# EAGLE design centerboard (EAGLE 5.09)
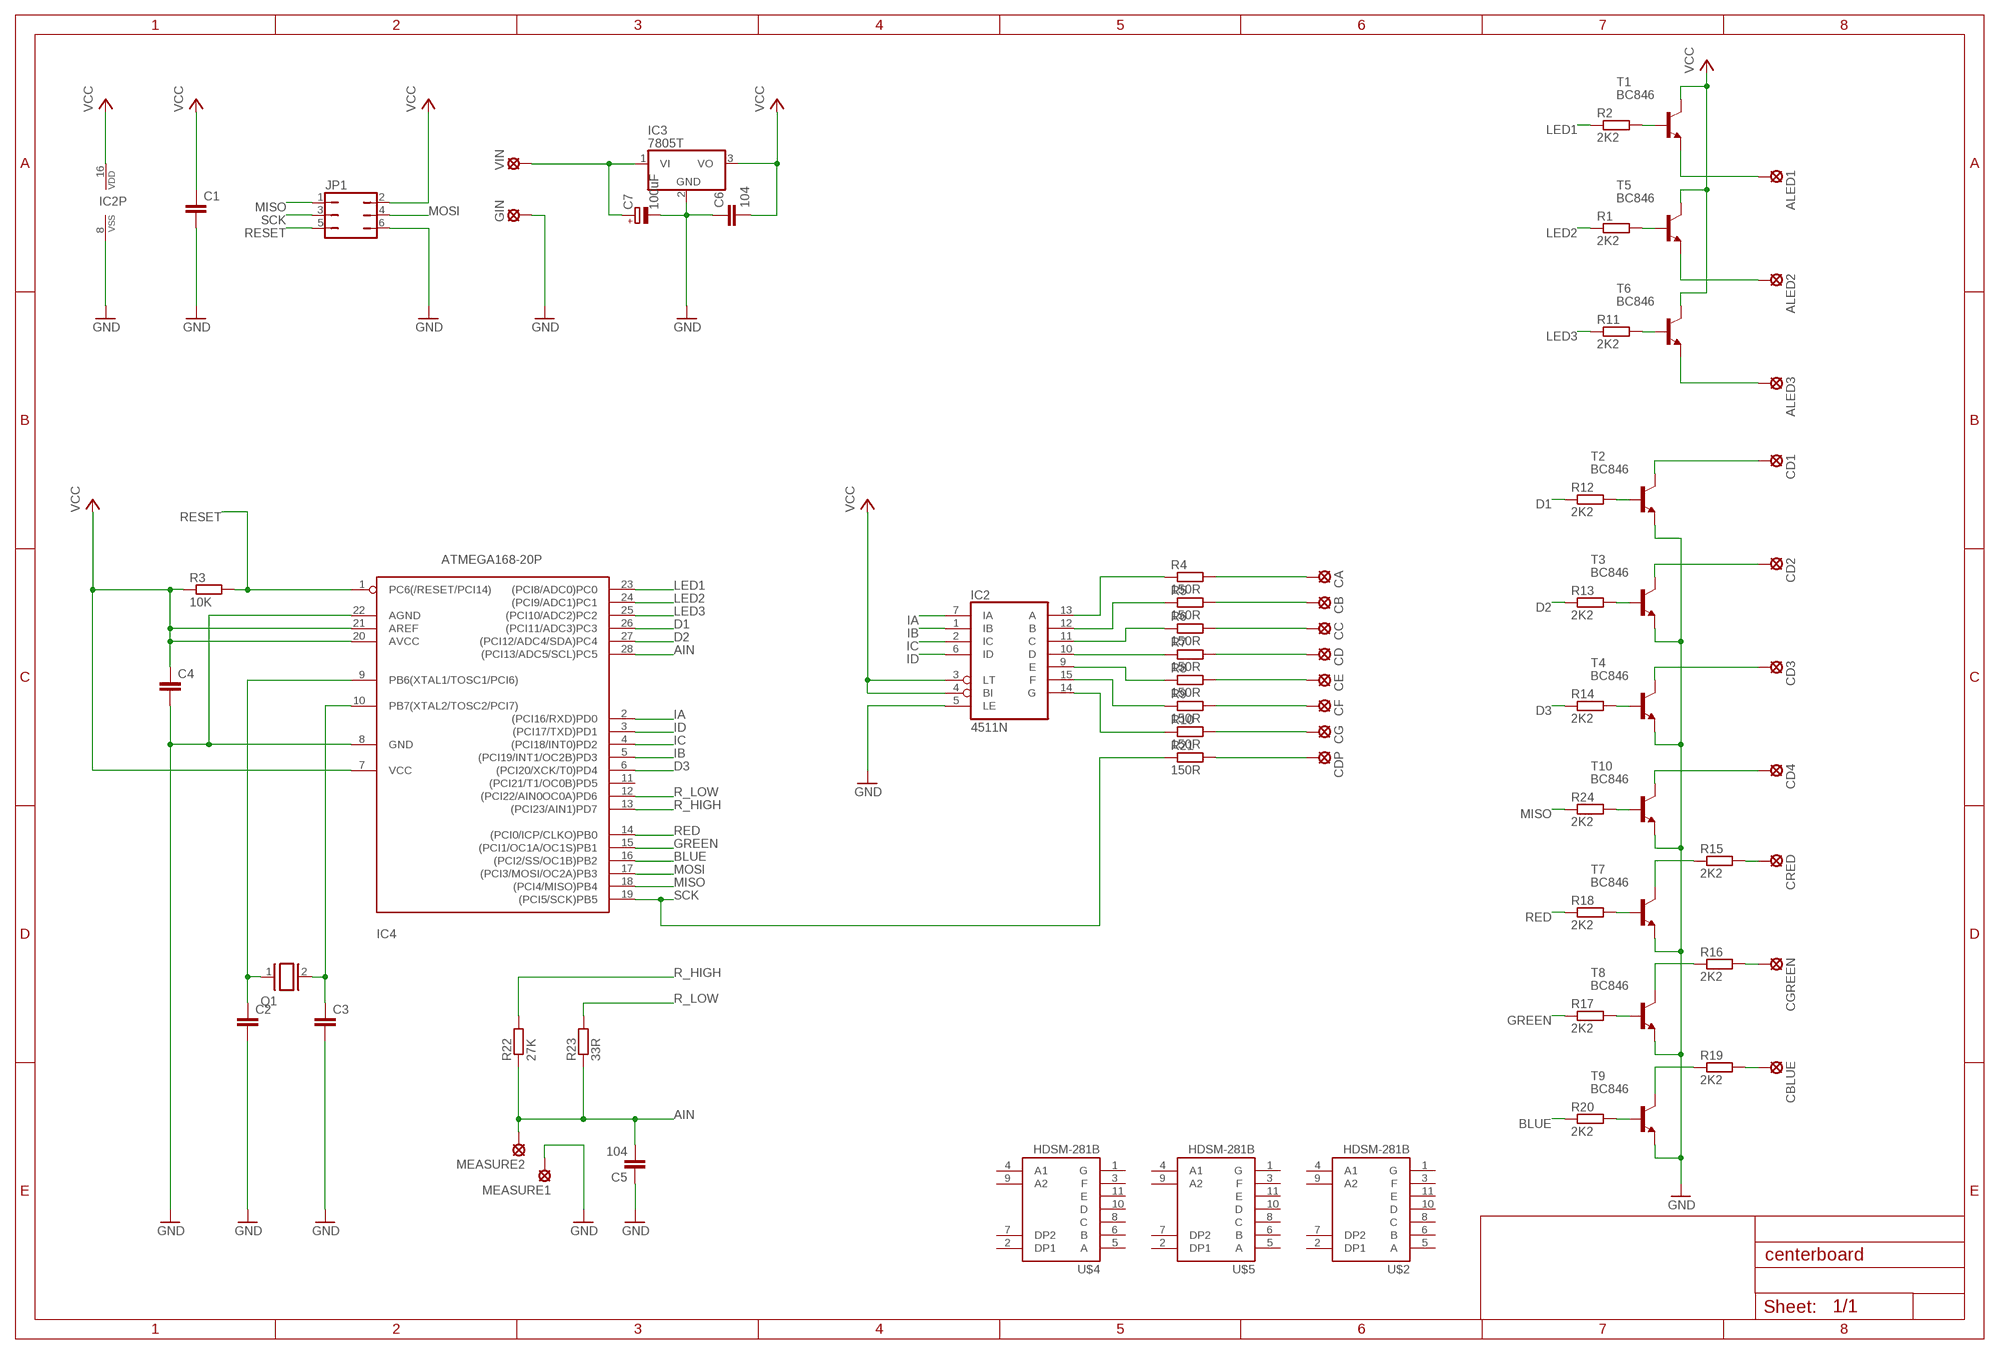
[diagram p0: schematic, sheet 1]

## Parts
ALED1  LSP10  [LSP10]
ALED2  LSP10  [LSP10]
ALED3  LSP10  [LSP10]
C1  C-EU025-024X044  [C025-024X044]
C2  C-EU025-024X044  [C025-024X044]
C3  C-EU025-024X044  [C025-024X044]
C4  C-EU025-024X044  [C025-024X044]
C5  104  C-EU025-024X044  [C025-024X044]
C6  104  C-EU025-024X044  [C025-024X044]
C7  100uF  CPOL-EUE2.5-5  [E2,5-5]
CA  LSP10  [LSP10]
CB  LSP10  [LSP10]
CBLUE  LSP10  [LSP10]
CC  LSP10  [LSP10]
CD  LSP10  [LSP10]
CD1  LSP10  [LSP10]
CD2  LSP10  [LSP10]
CD3  LSP10  [LSP10]
CD4  LSP10  [LSP10]
CDP  LSP10  [LSP10]
CE  LSP10  [LSP10]
CF  LSP10  [LSP10]
CG  LSP10  [LSP10]
CGREEN  LSP10  [LSP10]
CRED  LSP10  [LSP10]
GIN  LSP10  [LSP10]
IC2  4511N  [DIL16]
IC3  7805T  [TO220H]
IC4  ATMEGA168-20P  [DIL28-3]
JP1  JP3Q  [JP3Q]
MEASURE1  LSP10  [LSP10]
MEASURE2  LSP10  [LSP10]
Q1  XTAL/S  [QS]
R1  2K2  R-EU_R0805  [R0805]
R2  2K2  R-EU_R0805  [R0805]
R3  10K  R-EU_R0603  [R0603]
R4  150R  R-EU_R0805  [R0805]
R5  150R  R-EU_R0805  [R0805]
R6  150R  R-EU_R0805  [R0805]
R7  150R  R-EU_R0805  [R0805]
R8  150R  R-EU_R0805  [R0805]
R9  150R  R-EU_R0805  [R0805]
R10  150R  R-EU_R0805  [R0805]
R11  2K2  R-EU_R0805  [R0805]
R12  2K2  R-EU_R0805  [R0805]
R13  2K2  R-EU_R0805  [R0805]
R14  2K2  R-EU_R0805  [R0805]
R15  2K2  R-EU_R0805  [R0805]
R16  2K2  R-EU_R0805  [R0805]
R17  2K2  R-EU_R0805  [R0805]
R18  2K2  R-EU_R0805  [R0805]
R19  2K2  R-EU_R0805  [R0805]
R20  2K2  R-EU_R0805  [R0805]
R21  150R  R-EU_R0805  [R0805]
R22  27K  R-EU_R0805  [R0805]
R23  33R  R-EU_R0805  [R0805]
R24  2K2  R-EU_R0805  [R0805]
T1  BC846  [SOT23]
T2  BC846  [SOT23]
T3  BC846  [SOT23]
T4  BC846  [SOT23]
T5  BC846  [SOT23]
T6  BC846  [SOT23]
T7  BC846  [SOT23]
T8  BC846  [SOT23]
T9  BC846  [SOT23]
T10  BC846  [SOT23]
U$2  HDSM-281B  [HDSM-281B]
U$4  HDSM-281B  [HDSM-281B]
U$5  HDSM-281B  [HDSM-281B]
VIN  LSP10  [LSP10]

## Nets
AIN: C5.2 IC4.28((PCI13/ADC5/SCL)PC5) MEASURE2.MP R22.1 R23.1
BLUE: IC4.16((PCI2/SS/OC1B)PB2) R20.1
CF: CF.MP R9.2
D1: IC4.26((PCI11/ADC3)PC3) R12.1
D2: IC4.27((PCI12/ADC4/SDA)PC4) R13.1
D3: IC4.6((PCI20/XCK/T0)PD4) R14.1
GND: C1.2 C2.2 C3.2 C4.2 C5.1 C6.1 C7.- GIN.MP IC2.5(LE) IC2.8(VSS) IC3.2(GND) IC4.8(GND) IC4.22(AGND) JP1.6 MEASURE1.MP T2.2(E) T3.2(E) T4.2(E) T7.2(E) T8.2(E) T9.2(E) T10.2(E)
GREEN: IC4.15((PCI1/OC1A/OC1S)PB1) R17.1
IA: IC2.7(IA) IC4.2((PCI16/RXD)PD0)
IB: IC2.1(IB) IC4.5((PCI19/INT1/OC2B)PD3)
IC: IC2.2(IC) IC4.4((PCI18/INT0)PD2)
ID: IC2.6(ID) IC4.3((PCI17/TXD)PD1)
LED1: IC4.23((PCI8/ADC0)PC0) R2.1
LED2: IC4.24((PCI9/ADC1)PC1) R1.1
LED3: IC4.25((PCI10/ADC2)PC2) R11.1
MISO: IC4.18((PCI4/MISO)PB4) JP1.1 R24.1
MOSI: IC4.17((PCI3/MOSI/OC2A)PB3) JP1.4
N$1: R13.2 T3.1(B)
N$2: ALED1.MP T1.2(E)
N$3: R2.2 T1.1(B)
N$4: CA.MP R4.2
N$5: ALED2.MP T5.2(E)
N$6: R11.2 T6.1(B)
N$7: ALED3.MP T6.2(E)
N$8: R1.2 T5.1(B)
N$9: R18.2 T7.1(B)
N$10: CRED.MP R15.2
N$11: IC2.10(D) R7.1
N$12: CB.MP R5.2
N$13: IC2.11(C) R6.1
N$14: IC2.12(B) R5.1
N$15: IC2.13(A) R4.1
N$16: IC2.9(E) R8.1
N$17: CC.MP R6.2
N$18: IC2.15(F) R9.1
N$19: IC2.14(G) R10.1
N$20: C3.1 IC4.10(PB7(XTAL2/TOSC2/PCI7)) Q1.2
N$21: CD.MP R7.2
N$22: CE.MP R8.2
N$23: C2.1 IC4.9(PB6(XTAL1/TOSC1/PCI6)) Q1.1
N$24: CG.MP R10.2
N$25: R15.1 T7.3(C)
N$26: R16.1 T8.3(C)
N$27: R17.2 T8.1(B)
N$28: CGREEN.MP R16.2
N$29: R19.1 T9.3(C)
N$30: R20.2 T9.1(B)
N$31: CBLUE.MP R19.2
N$33: CDP.MP R21.2
N$35: C7.+ IC3.1(VI) VIN.MP
N$36: R24.2 T10.1(B)
N$38: CD3.MP T4.3(C)
N$39: CD1.MP T2.3(C)
N$40: CD2.MP T3.3(C)
N$41: CD4.MP T10.3(C)
N$44: R12.2 T2.1(B)
N$47: R14.2 T4.1(B)
R_HIGH: IC4.13((PCI23/AIN1)PD7) R22.2
R_LOW: IC4.12((PCI22/AIN0OC0A)PD6) R23.2
RED: IC4.14((PCI0/ICP/CLKO)PB0) R18.1
RESET: IC4.1(PC6(/RESET/PCI14)) JP1.5 R3.2
SCK: IC4.19((PCI5/SCK)PB5) JP1.3 R21.1
VCC: C1.1 C4.1 C6.2 IC2.3(LT) IC2.4(BI) IC2.16(VDD) IC3.3(VO) IC4.7(VCC) IC4.20(AVCC) IC4.21(AREF) JP1.2 R3.1 T1.3(C) T5.3(C) T6.3(C)
Unconnected: IC4.11((PCI21/T1/OC0B)PD5) U$2.1(G) U$2.2(DP1) U$2.3(F) U$2.4(A1) U$2.5(A) U$2.6(B) U$2.7(DP2) U$2.8(C) U$2.9(A2) U$2.10(D) U$2.11(E) U$4.1(G) U$4.2(DP1) U$4.3(F) U$4.4(A1) U$4.5(A) U$4.6(B) U$4.7(DP2) U$4.8(C) U$4.9(A2) U$4.10(D) U$4.11(E) U$5.1(G) U$5.2(DP1) U$5.3(F) U$5.4(A1) U$5.5(A) U$5.6(B) U$5.7(DP2) U$5.8(C) U$5.9(A2) U$5.10(D) U$5.11(E)

## Library data of the parts
ALED1-ALED3 CA CB CBLUE CC CD CD1-CD4 CDP CE CF CG CGREEN CRED GIN MEASURE1 MEASURE2 VIN = solpad:LSP10: SOLDER PAD drill 1.0 mm, distributor Buerklin, 12H555
C1-C6 = rcl:C-EU: CAPACITOR, European symbol
C7 = rcl:CPOL-EU: POLARIZED CAPACITOR, European symbol
IC2 = 45xx:4511: BCD to 7-segment LATCH/DECODER/DRIVER
IC3 = linear:78*: Positive VOLTAGE REGULATOR Source: http://cache.national.com/ds/LM/LM78L05.pdf http://www.fairchildsemi.com/ds/LM/LM7805.pdf
IC4 = avr:ATMEGA168*P: MICROCONTROLLER 16 kBytes FLASH 1 kBytes SRAM 512 Bytes EEPROM USART 8-channel 10 bit ADC
JP1 = jumper:JP3Q: JUMPER
Q1 = special:XTAL/S: CRYSTAL
R1-R24 = resistor:R-EU_: RESISTOR, European symbol
T1-T10 = transistor:BC846: NPN TRANSISTOR
U$2 U$4 U$5 = led:HDSM-281B

## Board
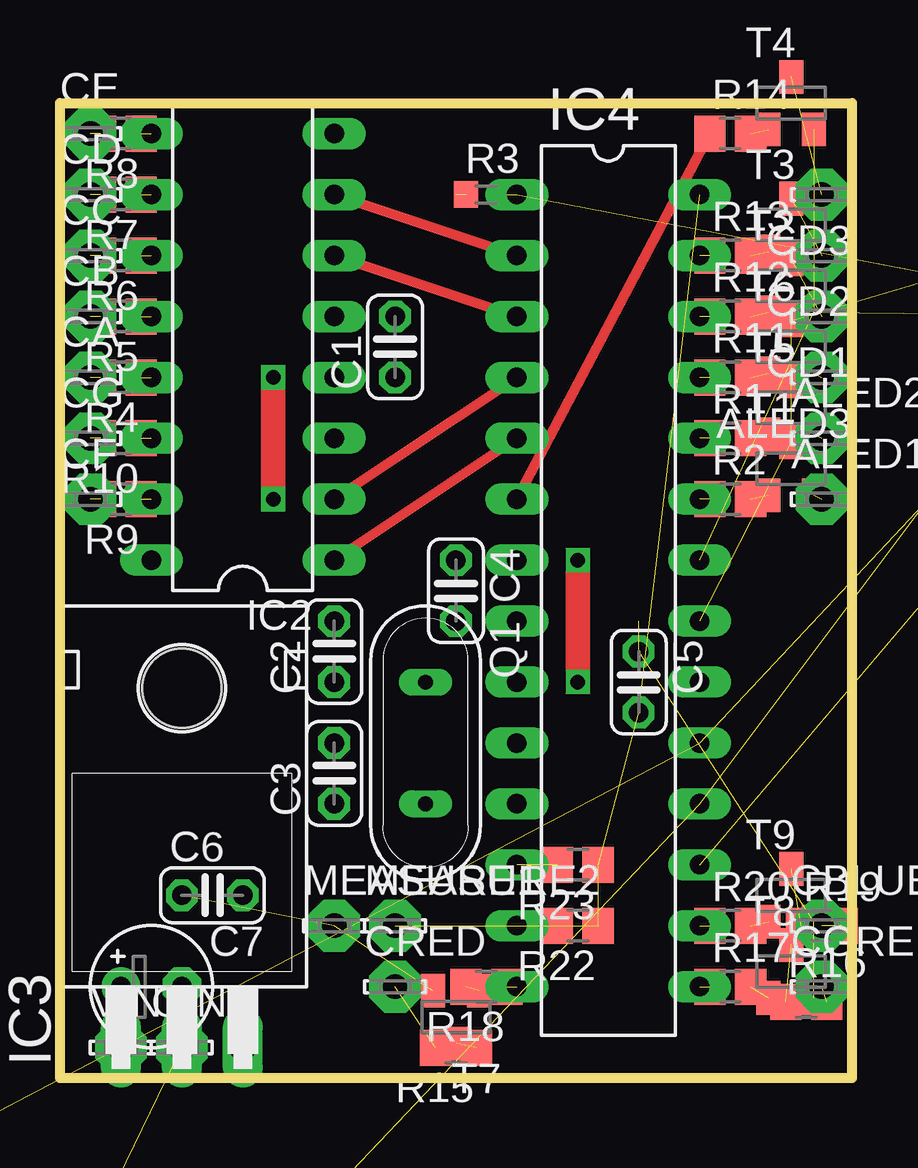
[diagram p1: board, top side]
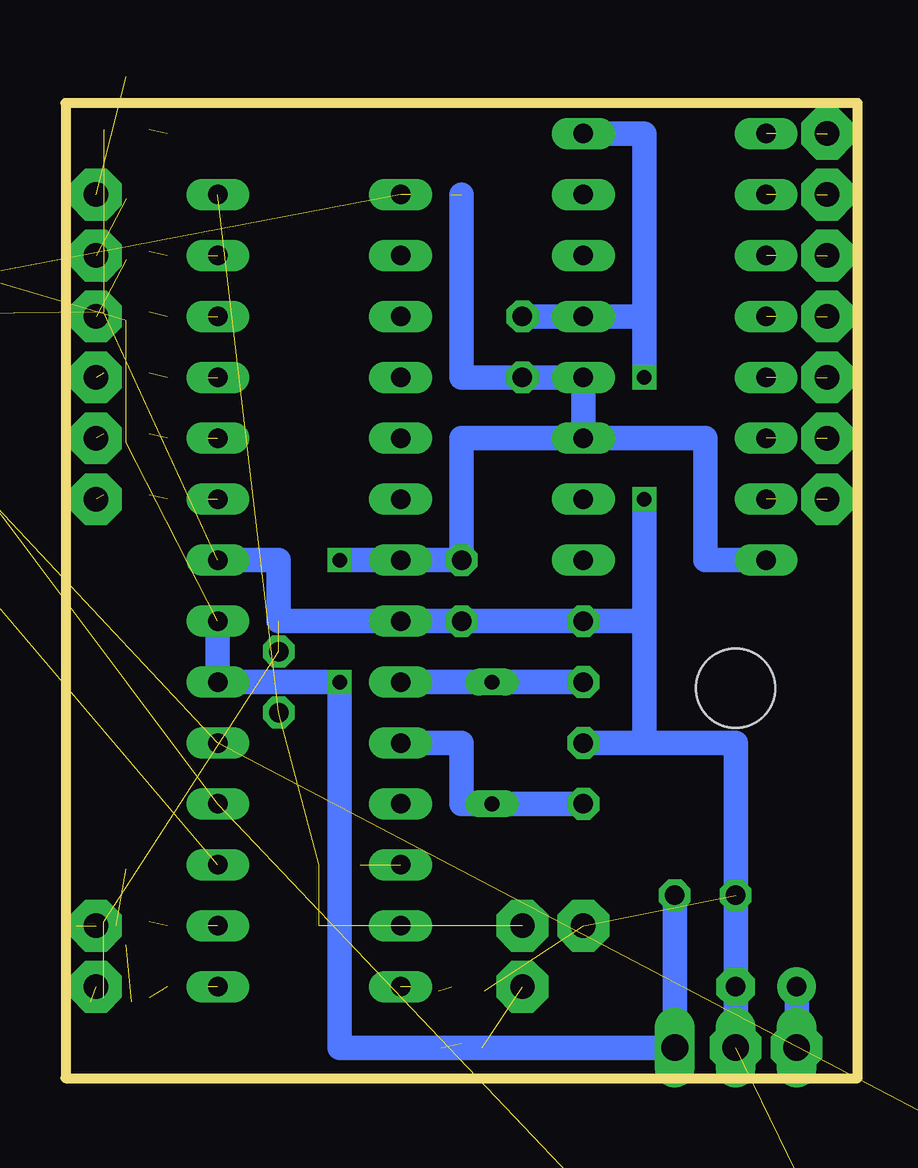
[diagram p2: board, bottom side, seen from below]

Size 33.02 x 40.64 mm. Coordinates in mm from the lower left corner, seen from the top.
Outline: 0,40.64 33.02,40.64 33.02,0 0,0 0,40.64
Copper layers (1*16): Top 0.035mm / dielectric 1.5mm / Bottom 0.035mm
Design rules "default": minimum track width 10mil, minimum drill 24mil, track to track 8mil, track to pad 8mil, pad to pad 8mil, via to via 8mil, smd to smd 8mil, copper to edge 40mil, drill to drill 8mil, minimum pad ring 10mil, minimum via ring 8mil, stop-mask expansion 4mil, vias tented up to drill 0mil, thermal gap 10mil

### Footprints (pad centres in the part's own frame; a part is rotated, then mirrored left to right if it is on the bottom)
LSP10 = drill 1.016 pad 2.159 octagon: MP 0,0
C025-024X044 = drill 0.813 octagon: 1 -1.27,0; 2 1.27,0
E2,5-5 = drill 0.813 pad 1.6 round: + -1.27,0 | drill 0.813 pad 1.6 octagon: - 1.27,0
DIL16 = drill 0.813 long: 1 -8.89,-3.81; 2 -6.35,-3.81; 3 -3.81,-3.81; 4 -1.27,-3.81; 5 1.27,-3.81; 6 3.81,-3.81; 7 6.35,-3.81; 8 8.89,-3.81; 9 8.89,3.81; 10 6.35,3.81; 11 3.81,3.81; 12 1.27,3.81; 13 -1.27,3.81; 14 -3.81,3.81; 15 -6.35,3.81; 16 -8.89,3.81
TO220H = drill 1.118 long: 1 -2.54,-10.16; 2 0,-10.16; 3 2.54,-10.16 | hole 3.302: 0,4.826
DIL28-3 = drill 0.813 long: 1 -16.51,-3.81; 2 -13.97,-3.81; 3 -11.43,-3.81; 4 -8.89,-3.81; 5 -6.35,-3.81; 6 -3.81,-3.81; 7 -1.27,-3.81; 8 1.27,-3.81; 9 3.81,-3.81; 10 6.35,-3.81; 11 8.89,-3.81; 12 11.43,-3.81; 13 13.97,-3.81; 14 16.51,-3.81; 15 16.51,3.81; 16 13.97,3.81; 17 11.43,3.81; 18 8.89,3.81; 19 6.35,3.81; 20 3.81,3.81; 21 1.27,3.81; 22 -1.27,3.81; 23 -3.81,3.81; 24 -6.35,3.81; 25 -8.89,3.81; 26 -11.43,3.81; 27 -13.97,3.81; 28 -16.51,3.81
JP3Q = drill 0.914 octagon: 1 -2.54,-1.27; 2 -2.54,1.27; 3 0,-1.27; 4 0,1.27; 5 2.54,-1.27; 6 2.54,1.27
QS = drill 0.61 long: 1 -2.54,0; 2 2.54,0
R0805 = smd 1.3 x 1.5: 1 -0.85,0; 2 0.85,0
R0603 = smd 1 x 1.1: 1 -0.85,0; 2 0.85,0
SOT23 = smd 1 x 1.4: 1 -0.95,-1.1; 2 0.95,-1.1; 3 0,1.1
HDSM-281B = smd 1 x 2.5: 1 -3.175,4.9; 2 -1.905,4.9; 3 -0.635,4.9; 4 0.635,4.9; 5 1.905,4.9; 6 3.175,4.9; 7 3.175,-4.9; 8 1.905,-4.9; 9 0.635,-4.9; 10 -0.635,-4.9; 11 -1.905,-4.9

### Placement (x,y rotation side)
ALED1  31.75,24.13 0 top
ALED2  31.75,26.67 0 top
ALED3  31.75,29.21 180 top
C1  13.97,30.48 90 top
C2  11.43,17.78 90 top
C3  11.43,12.7 90 top
C4  16.51,20.32 270 top
C5  24.13,16.51 270 top
C6  6.35,7.62 0 top
C7  3.81,3.81 0 top
CA  1.27,29.21 0 top
CB  1.27,31.75 0 top
CBLUE  31.75,6.35 0 top
CC  1.27,34.29 0 top
CD  1.27,36.83 0 top
CD1  31.75,31.75 180 top
CD2  31.75,34.29 180 top
CD3  31.75,36.83 180 top
CD4  -3.81,-29.21 0 top  (outside the outline)
CDP  1.27,-6.35 0 top  (outside the outline)
CE  1.27,39.37 0 top
CF  1.27,24.13 0 top
CG  1.27,26.67 0 top
CGREEN  31.75,3.81 0 top
CRED  13.97,3.81 0 top
GIN  5.08,1.27 0 top
IC2  7.62,30.48 90 top
IC3  5.08,11.43 0 top
IC4  22.86,20.32 270 top
JP1  46.99,34.29 270 top  (outside the outline)
MEASURE1  11.43,6.35 0 top
MEASURE2  13.97,6.35 0 top
Q1  15.24,13.97 270 top
R1  27.94,26.67 0 top
R2  27.94,24.13 0 top
R3  17.78,36.83 0 top
R4  2.54,29.21 180 top
R5  2.54,31.75 180 top
R6  2.54,34.29 180 top
R7  2.54,36.83 180 top
R8  2.54,39.37 180 top
R9  2.54,24.13 180 top
R10  2.54,26.67 180 top
R11  27.94,29.21 0 top
R12  27.94,31.75 0 top
R13  27.94,34.29 0 top
R14  27.94,39.37 0 top
R15  16.51,1.27 180 top
R16  31.11,3.18 0 top
R17  27.94,3.81 0 top
R18  17.78,3.81 180 top
R19  31.75,6.35 0 top
R20  27.94,6.35 0 top
R21  -6.35,-3.81 0 top  (outside the outline)
R22  21.59,6.35 180 top
R23  21.59,8.89 180 top
R24  -3.81,-21.59 0 top  (outside the outline)
T1  30.48,25.4 0 top
T2  30.48,33.02 0 top
T3  30.48,35.56 0 top
T4  30.48,40.64 0 top
T5  30.48,27.94 0 top
T6  30.48,30.48 0 top
T7  16.51,2.54 180 top
T8  30.48,4.45 0 top
T9  30.48,7.62 0 top
T10  -3.81,-13.97 0 top  (outside the outline)
U$2  78.74,43.18 0 top  (outside the outline)
U$4  69.85,43.18 0 top  (outside the outline)
U$5  60.96,43.18 0 top  (outside the outline)
VIN  2.54,1.27 0 top

### Tracks (layer width: path | path; a pad name or v marks a point on that pad's centre or on a via)
AIN  (4 unrouted)
BLUE  (1 unrouted)
CF  (1 unrouted)
D1  (1 unrouted)
D2  (1 unrouted)
D3
  Top 0.406: IC4.6 R14.1
GND  (via drill 0.6)  (10 unrouted)
  Top 1.016: v8.89,24.13 v8.89,29.21
  Bottom 1.016: 8.89,13.97 C3.2 | 8.89,13.97 8.89,19.05 | 8.89,19.05 C2.2 C4.2 IC4.8 24.13,19.05 24.13,21.59 IC4.22 | C1.2 IC2.5 8.89,31.75 | IC2.8 8.89,39.37 8.89,31.75 | v8.89,29.21 8.89,31.75 | 8.89,19.05 v8.89,24.13 | GIN.MP C7.- C6.1 5.08,13.97 8.89,13.97
GREEN  (1 unrouted)
IA
  Top 0.406: IC2.7 IC4.2
IB
  Top 0.406: IC2.1 IC4.5
IC
  Top 0.406: IC2.2 IC4.4
ID
  Top 0.406: IC2.6 IC4.3
LED1  (1 unrouted)
LED2  (1 unrouted)
LED3  (1 unrouted)
MISO  (2 unrouted)
MOSI  (1 unrouted)
N$1  (1 unrouted)
N$2  (1 unrouted)
N$3  (1 unrouted)
N$4  (1 unrouted)
N$5  (1 unrouted)
N$6  (1 unrouted)
N$7  (1 unrouted)
N$8  (1 unrouted)
N$9  (1 unrouted)
N$10  (1 unrouted)
N$11  (1 unrouted)
N$12  (1 unrouted)
N$13  (1 unrouted)
N$14  (1 unrouted)
N$15  (1 unrouted)
N$16  (1 unrouted)
N$17  (1 unrouted)
N$18  (1 unrouted)
N$19  (1 unrouted)
N$20
  Bottom 1.016: IC4.10 16.51,13.97 16.51,11.43 Q1.2 C3.1
N$21  (1 unrouted)
N$22  (1 unrouted)
N$23
  Bottom 1.016: IC4.9 Q1.1 C2.1
N$24  (1 unrouted)
N$25  (1 unrouted)
N$26  (1 unrouted)
N$27  (1 unrouted)
N$28  (1 unrouted)
N$29  (1 unrouted)
N$30  (1 unrouted)
N$31  (1 unrouted)
N$33  (1 unrouted)
N$35
  Bottom 1.016: VIN.MP C7.+
N$36  (1 unrouted)
N$38  (1 unrouted)
N$39  (1 unrouted)
N$40  (1 unrouted)
N$41  (1 unrouted)
N$44  (1 unrouted)
N$47  (1 unrouted)
R_HIGH  (1 unrouted)
R_LOW  (1 unrouted)
RED  (1 unrouted)
RESET  (2 unrouted)
SCK  (2 unrouted)
VCC  (via drill 0.6)  (5 unrouted)
  Top 1.016: v21.59,16.51 v21.59,21.59
  Bottom 1.016: IC4.21 IC4.20 v21.59,16.51 21.59,1.27 IC3.3 C6.2 | v21.59,21.59 IC4.7 C4.1 16.51,26.67 IC2.3 | IC2.16 6.35,21.59 6.35,26.67 IC2.3 | IC2.3 IC2.4 C1.1 16.51,29.21 16.51,36.83